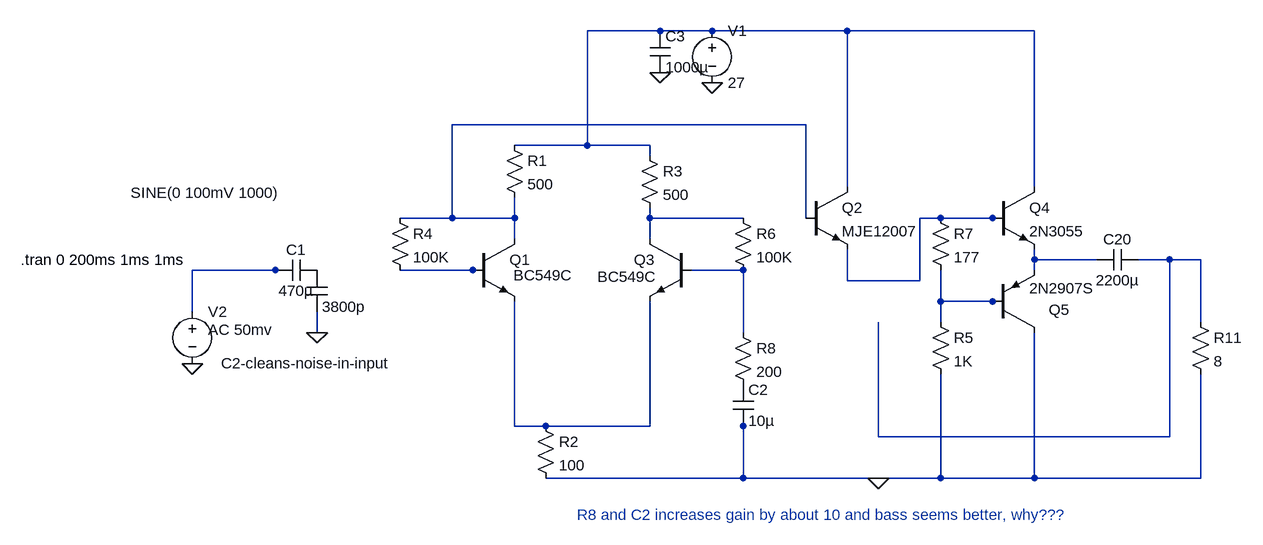
[diagram p0: schematic Base bias - long tail.asc]
Base bias - long tail.asc, the LTspice schematic file:
Version 4
SHEET 1 1788 680
WIRE 192 -256 80 -256
WIRE 272 -256 192 -256
WIRE 480 -256 272 -256
WIRE 768 -256 480 -256
WIRE 416 -112 -128 -112
WIRE 80 -80 80 -256
WIRE 80 -80 -32 -80
WIRE 176 -80 80 -80
WIRE 176 -64 176 -80
WIRE 480 -16 480 -256
WIRE 768 -16 768 -256
WIRE -128 32 -128 -112
WIRE -128 32 -208 32
WIRE -32 32 -32 0
WIRE -32 32 -128 32
WIRE 176 32 176 16
WIRE 320 32 176 32
WIRE 416 32 416 -112
WIRE 624 32 592 32
WIRE 704 32 624 32
WIRE 720 32 704 32
WIRE -32 64 -32 32
WIRE 176 64 176 32
WIRE 768 96 768 80
WIRE 864 96 768 96
WIRE 976 96 928 96
WIRE 1024 96 976 96
WIRE -400 112 -528 112
WIRE -384 112 -400 112
WIRE -96 112 -208 112
WIRE -80 112 -96 112
WIRE 320 112 240 112
WIRE 768 112 768 96
WIRE 480 128 480 80
WIRE 592 128 592 32
WIRE 592 128 480 128
WIRE 624 160 624 112
WIRE 704 160 624 160
WIRE 720 160 704 160
WIRE -528 176 -528 112
WIRE 624 192 624 160
WIRE 1024 192 1024 96
WIRE -336 208 -336 176
WIRE 320 208 320 112
WIRE -32 352 -32 160
WIRE 16 352 -32 352
WIRE 176 352 176 160
WIRE 176 352 16 352
WIRE 320 352 320 336
WIRE 528 368 528 192
WIRE 976 368 976 96
WIRE 976 368 528 368
WIRE 320 432 320 352
WIRE 320 432 16 432
WIRE 528 432 320 432
WIRE 624 432 624 272
WIRE 624 432 528 432
WIRE 768 432 768 208
WIRE 768 432 624 432
WIRE 1024 432 1024 272
WIRE 1024 432 768 432
FLAG -528 256 0
FLAG -336 208 0
FLAG 528 432 0
FLAG 272 -176 0
FLAG 192 -192 0
SYMBOL npn -96 64 R0
WINDOW 3 62 56 Left 2
SYMATTR Value BC549C
SYMATTR InstName Q1
SYMBOL res -48 -96 R0
SYMATTR InstName R1
SYMATTR Value 500
SYMBOL voltage 272 -272 R0
WINDOW 123 0 0 Left 2
WINDOW 39 0 0 Left 2
SYMATTR InstName V1
SYMATTR Value 27
SYMBOL res -224 16 R0
SYMATTR InstName R4
SYMATTR Value 100K
SYMBOL cap -336 96 R90
WINDOW 0 0 32 VBottom 2
WINDOW 3 32 32 VTop 2
SYMATTR InstName C1
SYMATTR Value 470µ
SYMBOL voltage -528 160 R0
WINDOW 123 24 44 Left 2
WINDOW 39 24 72 Left 2
WINDOW 3 -95 -167 Left 2
SYMATTR Value2 AC 50mv
SYMATTR Value SINE(0 100mV 1000)
SYMATTR InstName V2
SYMBOL npn2 704 -16 R0
SYMATTR InstName Q4
SYMATTR Value 2N3055
SYMBOL res 1008 176 R0
SYMATTR InstName R11
SYMATTR Value 8
SYMBOL pnp 704 208 M180
WINDOW 0 86 35 Left 2
SYMATTR InstName Q5
SYMATTR Value 2N2907S
SYMBOL cap 928 80 R90
WINDOW 0 0 32 VBottom 2
WINDOW 3 32 32 VTop 2
SYMATTR InstName C20
SYMATTR Value 2200µ
SYMBOL res 608 176 R0
SYMATTR InstName R5
SYMATTR Value 1K
SYMBOL res 608 16 R0
SYMATTR InstName R7
SYMATTR Value 177
SYMBOL npn 416 -16 R0
SYMATTR InstName Q2
SYMATTR Value MJE12007
SYMBOL cap -352 112 R0
WINDOW 0 -132 143 Left 2
SYMATTR InstName C2-cleans-noise-in-input
SYMATTR Value 3800p
SYMBOL npn 240 64 M0
WINDOW 3 54 58 Left 2
SYMATTR Value BC549C
SYMATTR InstName Q3
SYMBOL res 0 336 R0
SYMATTR InstName R2
SYMATTR Value 100
SYMBOL res 160 -80 R0
SYMATTR InstName R3
SYMATTR Value 500
SYMBOL res 304 16 R0
SYMATTR InstName R6
SYMATTR Value 100K
SYMBOL res 304 192 R0
SYMATTR InstName R8
SYMATTR Value 200
SYMBOL cap 304 288 R0
SYMATTR InstName C2
SYMATTR Value 10µ
SYMBOL cap 176 -256 R0
SYMATTR InstName C3
SYMATTR Value 1000µ
TEXT -792 96 Left 2 !.tran 0 200ms 1ms 1ms
TEXT 64 488 Left 2 ;R8 and C2 increases gain by about 10 and bass seems better, why???

The netlist it stands for:
* Base bias - long tail.asc
Q1 N002 N008 N011 0 BC549C
R1 N001 N002 500
V1 N001 0 27
R4 N002 N008 100K
C1 P001 N007 470µ
V2 N007 0 SINE(0 100mV 1000) AC 50mv
Q4 N001 N004 N005 0 2N3055
R11 N006 0 8
Q5 0 N010 N005 0 2N2907S
C20 N006 N005 2200µ
R5 N010 0 1K
R7 N004 N010 177
Q2 N001 N002 N004 0 MJE12007
C2-cleans-noise-in-input P001 0 3800p
Q3 N003 N009 N011 0 BC549C
R2 N011 0 100
R3 N001 N003 500
R6 N003 N009 100K
R8 N009 P002 200
C2 P002 0 10µ
C3 N001 0 1000µ
.model NPN NPN
.model PNP PNP
.lib standard.bjt
.tran 0 200ms 1ms 1ms
* R8 and C2 increases gain by about 10 and bass seems better, why???
.backanno
.end